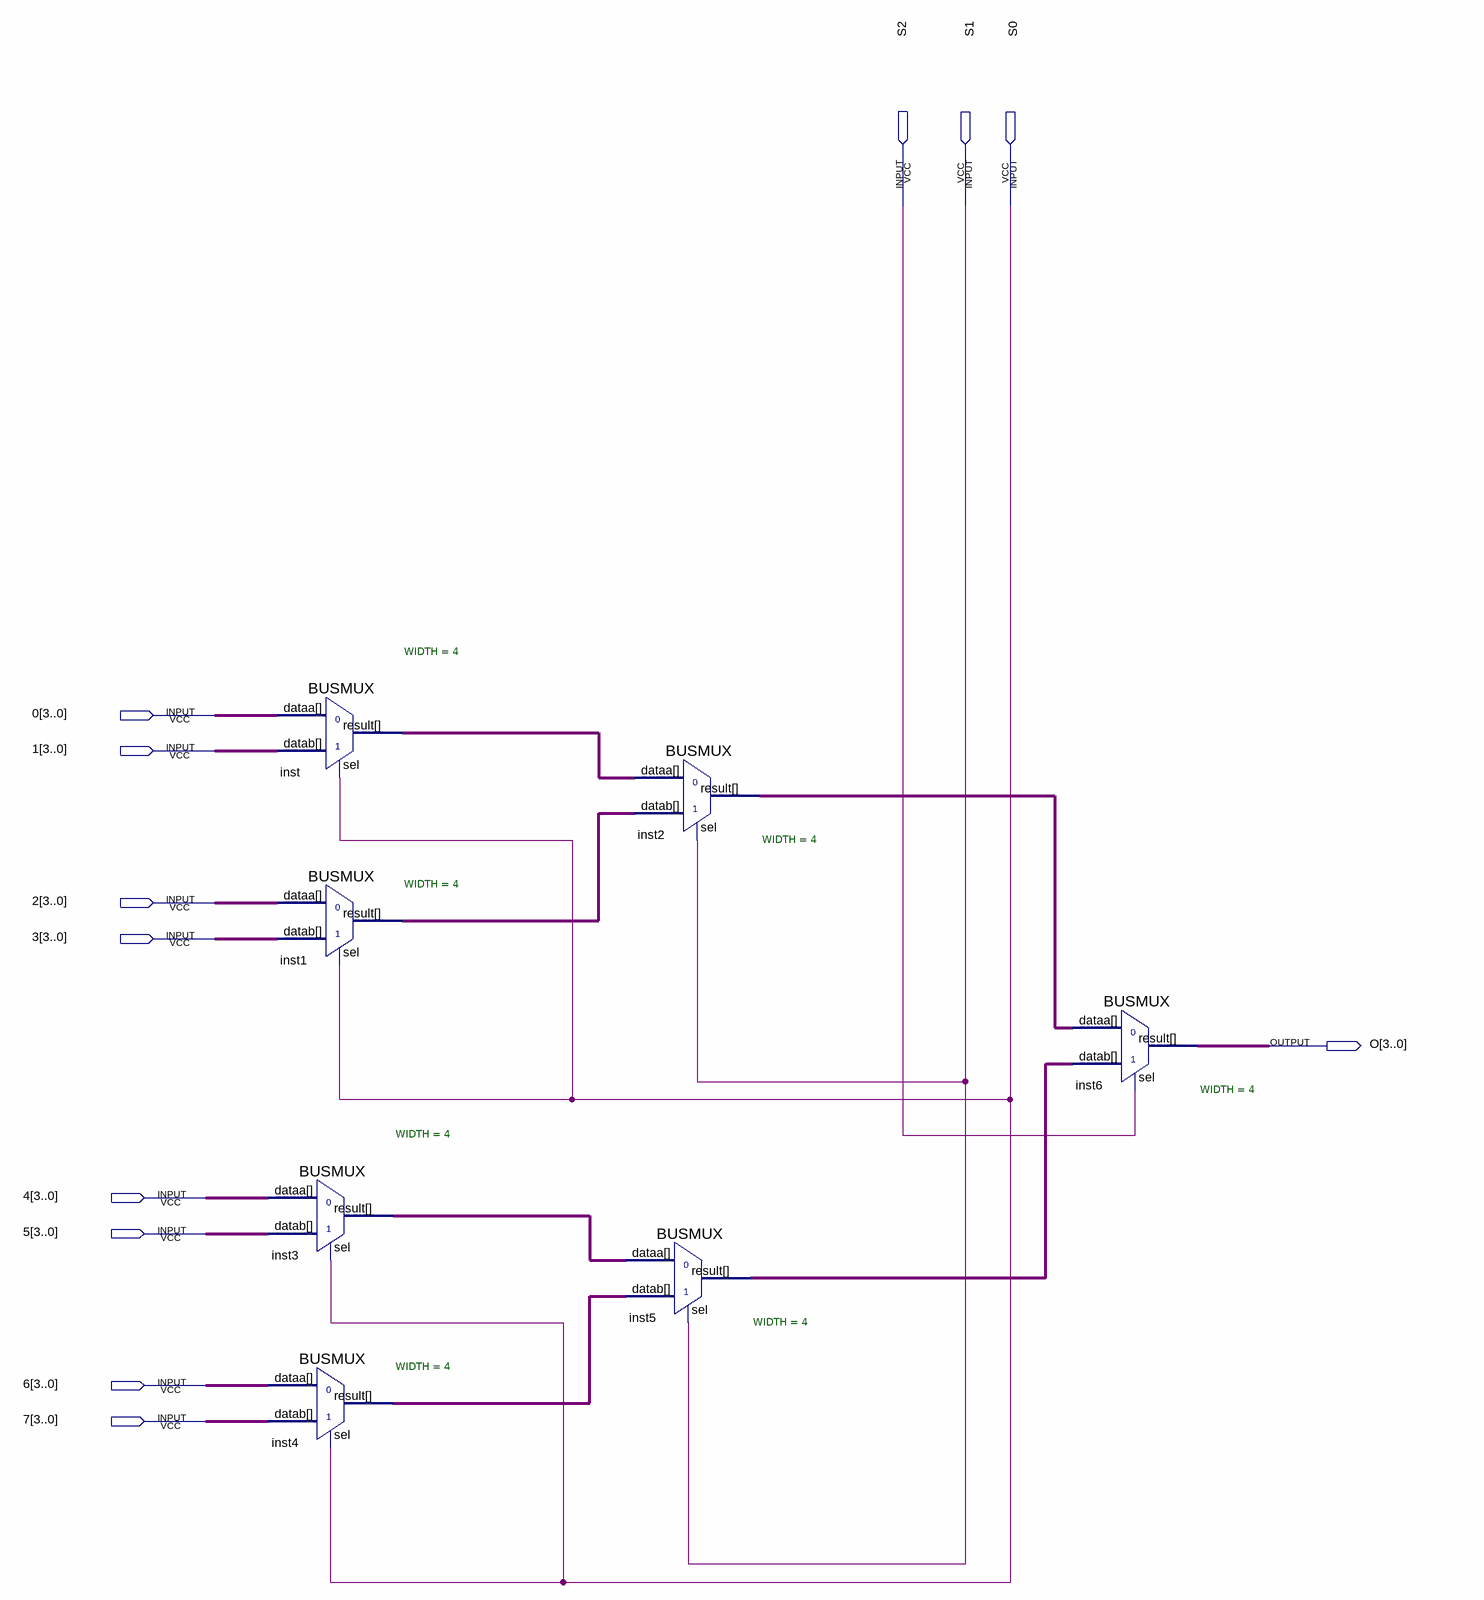
[diagram p0: schematic sheet]
// Quartus schematic Mux8x1.bdf as structural Verilog: 7 symbols, 12 pins
module Mux8x1 (
  input  S2,
  input  S1,
  input  S0,
  input  [3:0] \0 ,
  input  [3:0] \1 ,
  input  [3:0] \2 ,
  input  [3:0] \3 ,
  input  [3:0] \4 ,
  input  [3:0] \5 ,
  input  [3:0] \6 ,
  input  [3:0] \7 ,
  output [3:0] O
);

  wire [3:0] inst1_result, inst2_result, inst3_result, inst4_result, inst5_result, inst_result;

  BUSMUX #(.WIDTH(4)) inst (.datab(\1 ), .sel(S0), .dataa(\0 ), .result(inst_result));
  BUSMUX #(.WIDTH(4)) inst1 (.datab(\3 ), .sel(S0), .dataa(\2 ), .result(inst1_result));
  BUSMUX #(.WIDTH(4)) inst3 (.datab(\5 ), .sel(S0), .dataa(\4 ), .result(inst3_result));
  BUSMUX #(.WIDTH(4)) inst4 (.datab(\7 ), .sel(S0), .dataa(\6 ), .result(inst4_result));
  BUSMUX #(.WIDTH(4)) inst2 (.datab(inst1_result), .sel(S1), .dataa(inst_result), .result(inst2_result));
  BUSMUX #(.WIDTH(4)) inst5 (.datab(inst4_result), .sel(S1), .dataa(inst3_result), .result(inst5_result));
  BUSMUX #(.WIDTH(4)) inst6 (.datab(inst5_result), .sel(S2), .dataa(inst2_result), .result(O));
endmodule
